# Altium schematic sheet Power.SchDoc
size A4; SheetNumber: 3; SheetTotal: 3
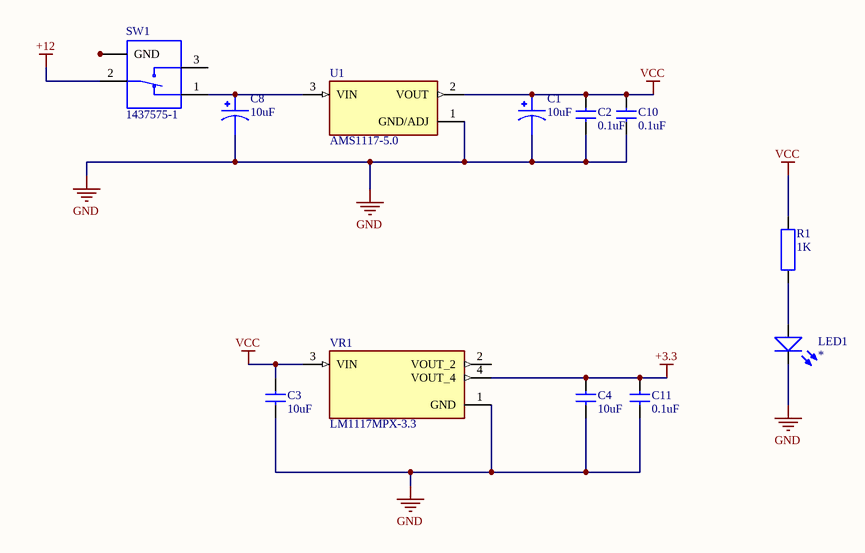
[diagram p0: Power.SchDoc]

## Parts
C1  10uF  [CAPM3216X180]
C2  0.1uF  [SMD_CAPACITOR_0805]
C3  10uF  [SMD_CAPACITOR_0805]
C4  10uF  [SMD_CAPACITOR_0805]
C8  10uF  [CAPM3216X180]
C10  0.1uF  [SMD_CAPACITOR_0805]
C11  0.1uF  [SMD_CAPACITOR_0805]
LED1  *  [SMD_LED_0805]
R1  1K  [SMD_RESISTOR_0805]
SW1  1437575-1  [SW_MLL1200S]
U1  AMS1117-5.0  [SOT229P700X180-4N]
VR1  LM1117MPX-3.3  [VREG_LM1117MPX-3.3]

## Nets
+3.3: C4.1 C11.1 VR1.4(VOUT_4)
+12: SW1.2
GND: C1.2 C2.2 C3.2 C4.2 C8.2 C10.2 C11.2 LED1.2 U1.1(GND/ADJ) VR1.1(GND)
VCC: C1.1 C2.1 C3.1 C10.1 R1.1 U1.2(VOUT) VR1.3(VIN)
NetC8_1: C8.1 SW1.1 U1.3(VIN)
NetLED1_1: LED1.1 R1.2
NetSW1_G1: SW1.G1(GND) SW1.G2(GND) SW1.G3(GND) SW1.G4(GND)

Not connected (* = marked no-connect by the designer): SW1 3; VR1 2(VOUT_2)

## Library data of the parts
C1 C8 = F971A106KAA: 10 ÂµF Molded Tantalum Capacitors 10 V 1206 (3216 Metric) 3Ohm; MF: AVX; SnapEDA_Link: https://www.snapeda.com/parts/F971A106KAA/AVX/view-part/?ref=snap; MP: F971A106KAA; Check_prices: https://www.snapeda.com/parts/F971A106KAA/AVX/view-part/?ref=eda; Package: 1206 AVX; Purchase-URL: https://pricing.snapeda.com/search/part/F971A106KAA/?ref=eda; Value: 10uF; Digi-Key_Part_Number: 478-8540-2-ND
C2-C4 C10 C11 = Capacitor: 0805: http://cz.farnell.com/webapp/wcs/stores/servlet/Search?catalogId=15001&langId=420&storeId=10156&categoryId=700000005423&sort=P_PRICE&pageSize=100&beginIndex=1&showResults=true&sf=502,707&pf=1010141074,1012080068,1012245578; 1206: http://cz.farnell.com/webapp/wcs/stores/servlet/Search?catalogId=15001&langId=420&storeId=10156&categoryId=700000005423&sort=P_PRICE&pageSize=100&beginIndex=1&showResults=true&sf=502,707&pf=1012245584
  C2 C10 C11: Value: 0.1uF
  C3 C4: Value: 10uF
LED1 = LED: SUPER_BRIGHT: http://cz.farnell.com/kingbright/ka-3535sylz4s/led-hb-yellow-525mw-12lm/dp/2373359+; 0805: http://cz.farnell.com/webapp/wcs/stores/servlet/Search?catalogId=15001&langId=420&storeId=10156&categoryId=700000006139&sort=P_PRICE&pageSize=100&showResults=true&sf=502,707&pf=1010144644,1010253269; 1206: http://cz.farnell.com/webapp/wcs/stores/servlet/Search?catalogId=15001&langId=420&storeId=10156&categoryId=700000006139&sort=P_PRICE&pageSize=100&showResults=true&sf=502,707&pf=1010144644,1010305184; 5MM: http://cz.farnell.com/webapp/wcs/stores/servlet/Search?catalogId=15001&langId=420&storeId=10156&categoryId=700000006139&sort=P_PRICE&pageSize=100&showResults=true&sf=502,707&pf=1010195550,1012220634; 3MM: http://cz.farnell.com/webapp/wcs/stores/servlet/Search?catalogId=15001&langId=420&storeId=10156&categoryId=700000006139&sort=P_PRICE&pageSize=100&showResults=true&sf=502,707&pf=1010173716,1012220634; Value: *
R1 = Resistor: 1206: http://cz.farnell.com/webapp/wcs/stores/servlet/Search?catalogId=15001&langId=420&storeId=10156&categoryId=700000005450&pageSize=100&showResults=true&sf=502,707&pf=1012211755; 0805: http://cz.farnell.com/webapp/wcs/stores/servlet/Search?catalogId=15001&langId=420&storeId=10156&categoryId=700000005450&sort=P_PRICE&pageSize=100&showResults=true&sf=502,707&pf=1012211743; Value: 1K
SW1 = 1437575-1: Slide Switch 4PDT Through Hole, Right Angle; MF: TE Connectivity; Package: None; Value: *; Price: None; Availability: Unavailable; MP: 1437575-1; SnapEDA_Link: https://www.snapeda.com/parts/1437575-1/TE%20Connectivity%20ALCOSWITCH%20Switches/view-part/3594208/?ref=snap
U1 = AMS1117-5.0: 1A LOW DROPOUT VOLTAGE REGULATOR; MF: ams; MP: AMS1117-5.0; Package: SOT-223 Seeed Technology; SnapEDA_Link: https://www.snapeda.com/parts/AMS1117-5.0/ams/view-part/?ref=snap; Check_prices: https://www.snapeda.com/parts/AMS1117-5.0/ams/view-part/?ref=eda; Availability: Not in stock; Value: *; Price: None
VR1 = LM1117MPX-3.3: 800-mA 15-V linear voltage regulator; MF: Texas Instruments; Check_prices: https://www.snapeda.com/parts/LM1117MPX-3.3/Texas+Instruments/view-part/?ref=eda; Value: *; Availability: In Stock; MP: LM1117MPX-3.3; Price: None; Package: SOT-223-4 Texas Instruments; SnapEDA_Link: https://www.snapeda.com/parts/LM1117MPX-3.3/Texas+Instruments/view-part/?ref=snap; Purchase-URL: https://pricing.snapeda.com/search/part/LM1117MPX-3.3/?ref=eda